# EAGLE design DUE shield (EAGLE 6.3)
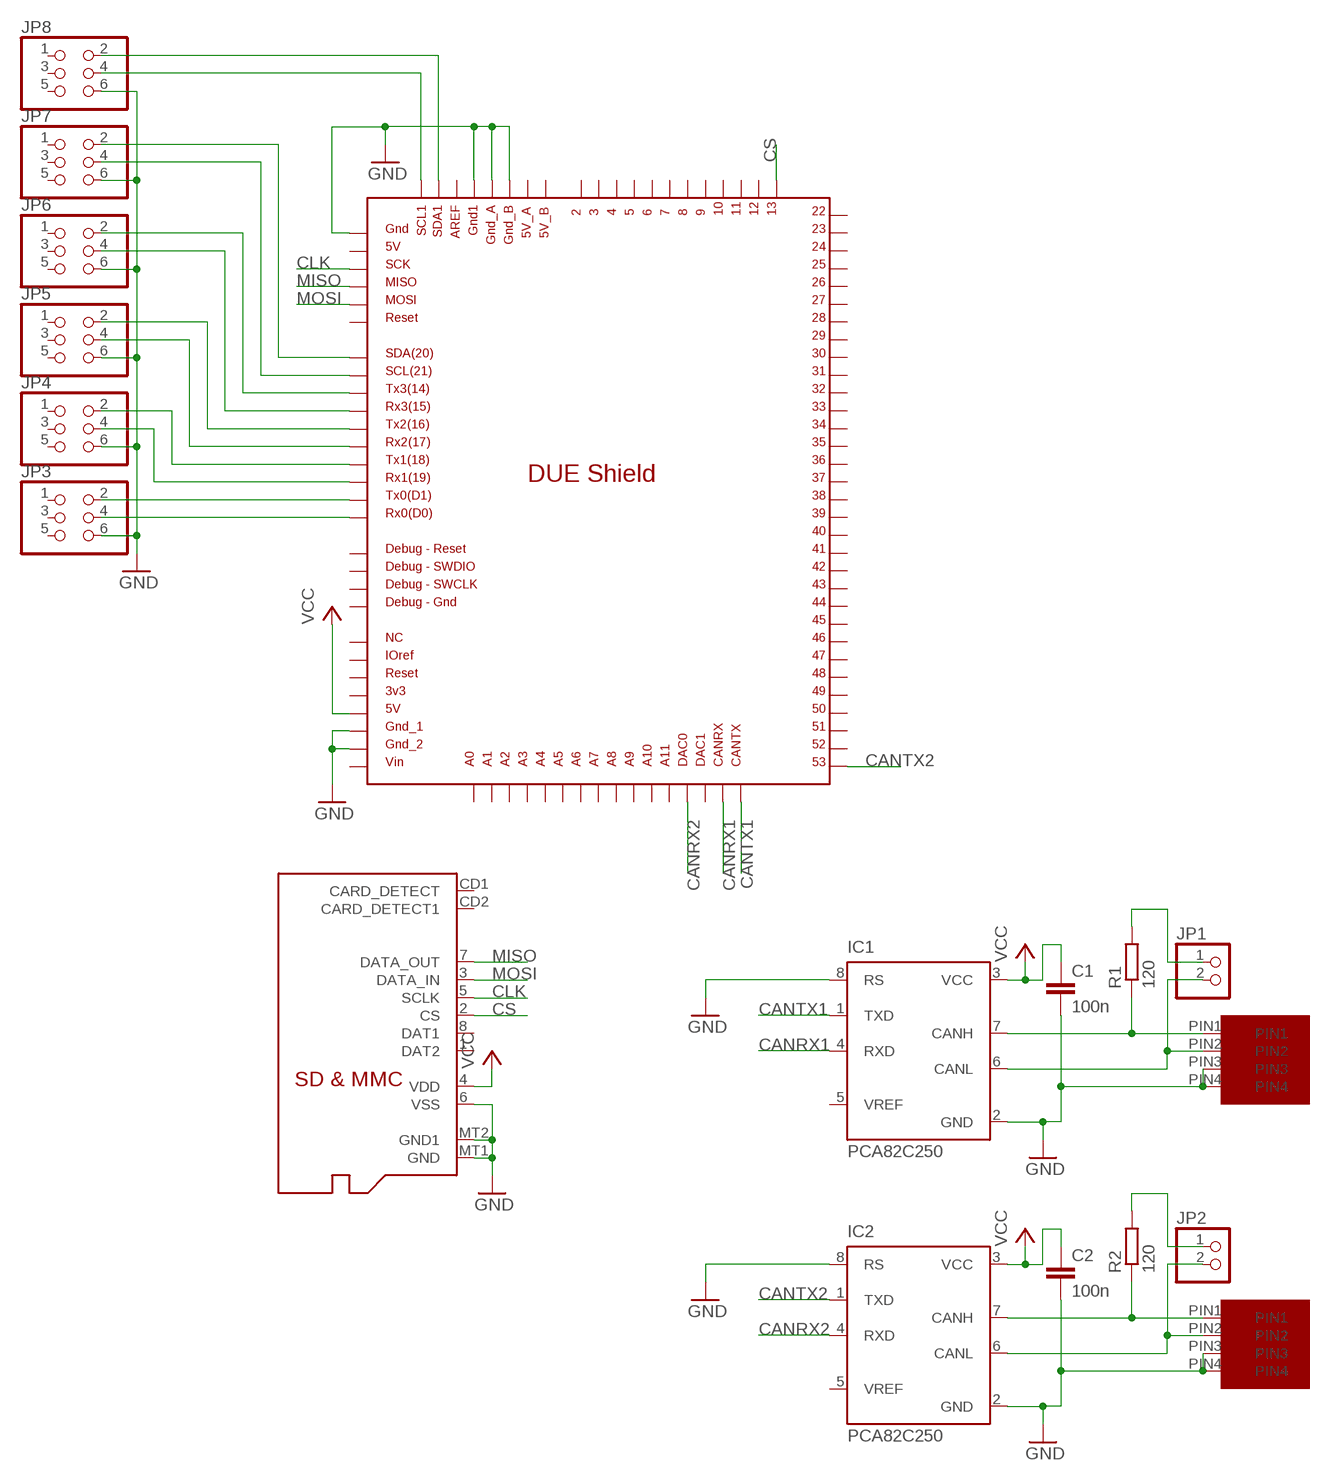
[diagram p0: schematic, sheet 1]

## Parts
C1  100n  C-EU050-024X044  [C050-024X044]
C2  100n  C-EU050-024X044  [C050-024X044]
IC1  PCA82C250  [DIL08]
IC2  PCA82C250  [DIL08]
JP1  PINHD-1X2  [1X02]
JP2  PINHD-1X2  [1X02]
JP3  PINHD-2X3  [2X03]
JP4  PINHD-2X3  [2X03]
JP5  PINHD-2X3  [2X03]
JP6  PINHD-2X3  [2X03]
JP7  PINHD-2X3  [2X03]
JP8  PINHD-2X3  [2X03]
R1  120  R-EU_0204/7  [0204/7]
R2  120  R-EU_0204/7  [0204/7]
U$1  DUE(NORMAL)  [DUE(NORMAL)]
U$2  MICROFIT4  [MICROFIT4SOCK]
U$3  MICROFIT4  [MICROFIT4SOCK]
U$4  MICROSD  [MICROSD]

## Nets
CANRX1: IC1.4(RXD) U$1.CANRX
CANRX2: IC2.4(RXD) U$1.DAC0
CANTX1: IC1.1(TXD) U$1.CANTX
CANTX2: IC2.1(TXD) U$1.53
CLK: U$1.SCK_ICSP U$4.5(SCLK)
CS: U$1.13 U$4.2(CS)
GND: C1.2 C2.2 IC1.2(GND) IC1.8(RS) IC2.2(GND) IC2.8(RS) JP3.6 JP4.6 JP5.6 JP6.6 JP7.6 JP8.6 U$1.5V_ICSP U$1.GND1 U$1.GND_1 U$1.GND_2 U$1.GND_A U$1.GND_B U$2.PIN3 U$2.PIN4 U$3.PIN3 U$3.PIN4 U$4.6(VSS) U$4.MT1(GND) U$4.MT2(GND1)
MISO: U$1.MISO_ICSP U$4.7(DATA_OUT)
MOSI: U$1.MOSI_ICSP U$4.3(DATA_IN)
N$1: IC1.7(CANH) R1.1 U$2.PIN1
N$2: IC1.6(CANL) JP1.2 U$2.PIN2
N$3: JP1.1 R1.2
N$4: JP6.2 U$1.TX3
N$5: IC2.7(CANH) R2.1 U$3.PIN1
N$6: IC2.6(CANL) JP2.2 U$3.PIN2
N$7: JP2.1 R2.2
N$8: JP6.4 U$1.RX3
N$9: JP5.2 U$1.TX2
N$10: JP5.4 U$1.RX2
N$11: JP4.2 U$1.TX1
N$12: JP4.4 U$1.RX1
N$13: JP3.2 U$1.TX0
N$14: JP3.4 U$1.RX0
N$15: JP7.4 U$1.SCL
N$16: JP7.2 U$1.SDA
N$32: JP8.4 U$1.SCL1
N$33: JP8.2 U$1.SDA1
VCC: C1.1 C2.1 IC1.3(VCC) IC2.3(VCC) U$1.5V U$4.4(VDD)
Unconnected: IC1.5(VREF) IC2.5(VREF) JP3.1 JP3.3 JP3.5 JP4.1 JP4.3 JP4.5 JP5.1 JP5.3 JP5.5 JP6.1 JP6.3 JP6.5 JP7.1 JP7.3 JP7.5 JP8.1 JP8.3 JP8.5 U$1.2 U$1.3 U$1.3V3 U$1.4 U$1.5 U$1.5V_A U$1.5V_B U$1.6 U$1.7 U$1.8 U$1.9 U$1.10 U$1.11 U$1.12 U$1.22 U$1.23 U$1.24 U$1.25 U$1.26 U$1.27 U$1.28 U$1.29 U$1.30 U$1.31 U$1.32 U$1.33 U$1.34 U$1.35 U$1.36 U$1.37 U$1.38 U$1.39 U$1.40 U$1.41 U$1.42 U$1.43 U$1.44 U$1.45 U$1.46 U$1.47 U$1.48 U$1.49 U$1.50 U$1.51 U$1.52 U$1.A0 U$1.A1 U$1.A2 U$1.A3 U$1.A4 U$1.A5 U$1.A6 U$1.A7 U$1.A8 U$1.A9 U$1.A10 U$1.A11 U$1.AREF U$1.DAC1 U$1.GND_DEBUG U$1.GND_ICSP U$1.IOREF U$1.NC U$1.RESET U$1.RESET_DEBUG U$1.RESET_ICSP U$1.SWCLK_DEBUG U$1.SWDIO_DEBUG U$1.VIN U$4.1(DAT2) U$4.8(DAT1) U$4.CD1(CARD_DETECT) U$4.CD2(CARD_DETECT1)

## Library data of the parts
C1 C2 = rcl:C-EU: CAPACITOR, European symbol
IC1 IC2 = micro-philips:PCA82C250: CAN CONTROLLER INTERFACE; OC_FARNELL: 3692358; OC_NEWARK: unknown
JP1 JP2 = pinhead:PINHD-1X2: PIN HEADER
JP3-JP8 = pinhead:PINHD-2X3: PIN HEADER
R1 R2 = resistor:R-EU_: RESISTOR, European symbol
U$1 = DUElib130425:DUE(NORMAL)
U$2 U$3 = unicorn:MICROFIT4
U$4 = adafruit:MICROSD: Micro-SD / Transflash card holder with SPI pinout For the 3M # 2908-05WB-MG and/or 4UCON #19656 push-push type

## Board
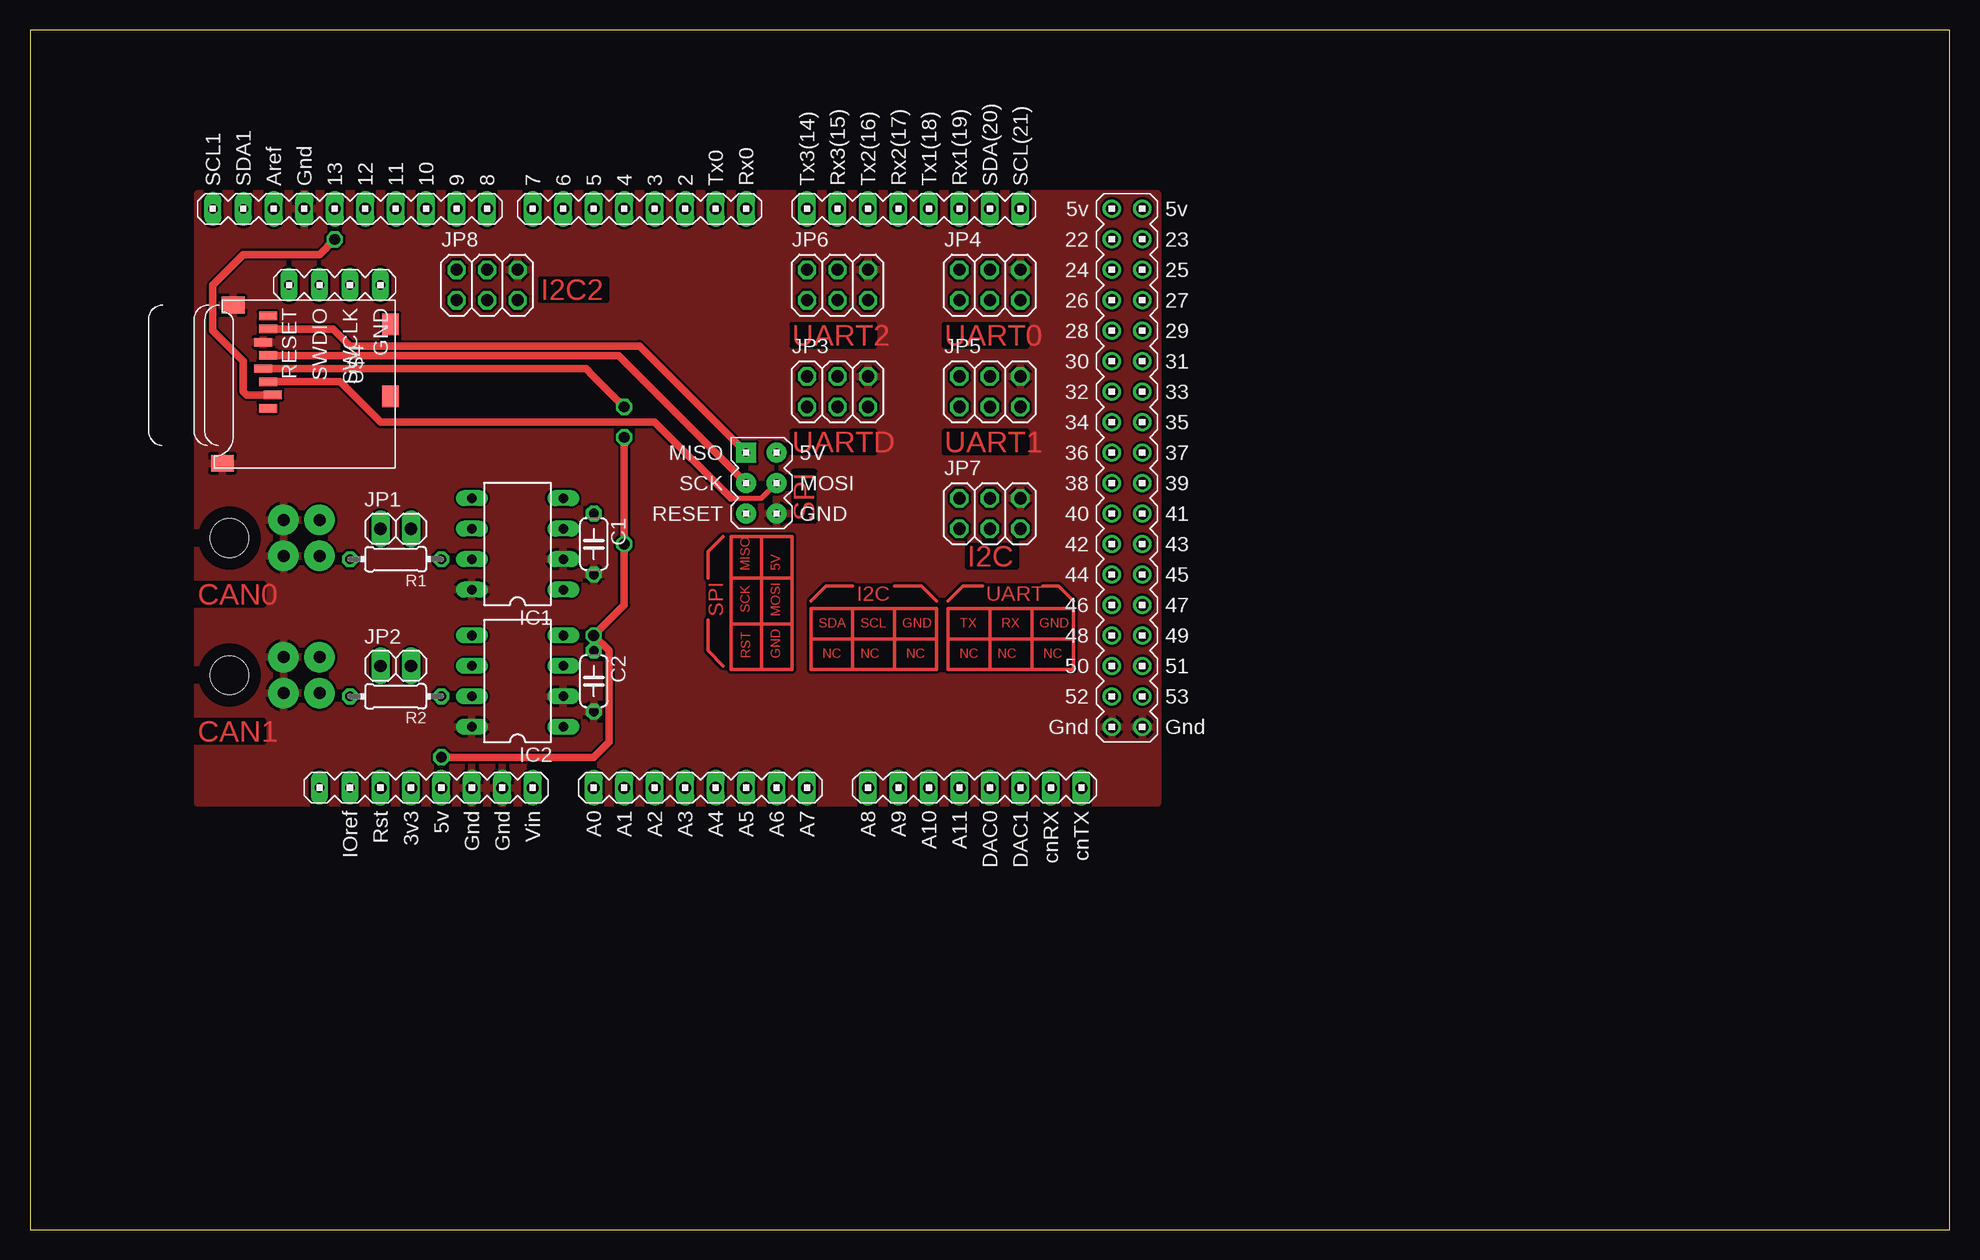
[diagram p1: board, top side]
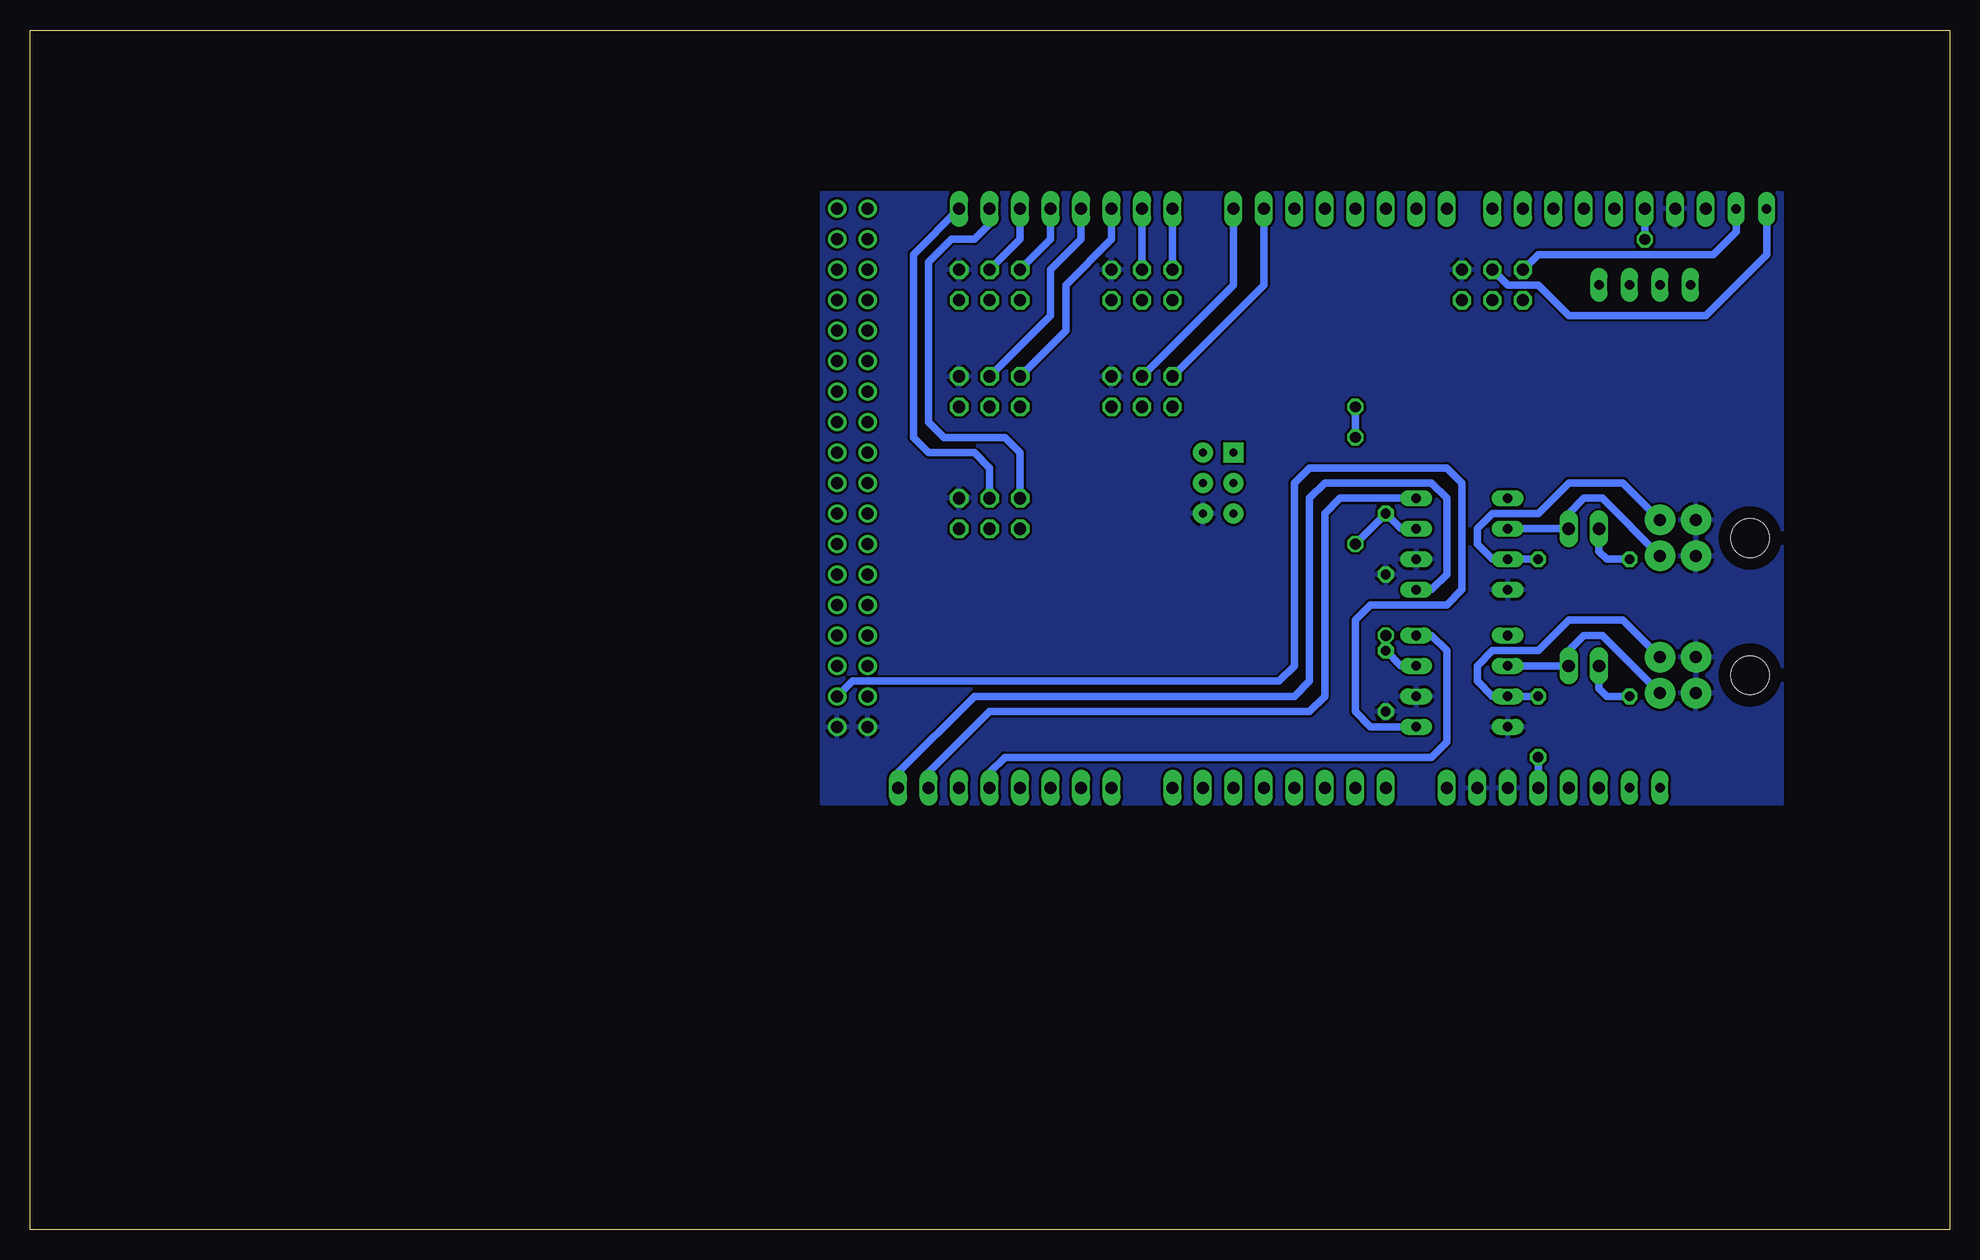
[diagram p2: board, bottom side, seen from below]

Size 160 x 100 mm. Coordinates in mm from the lower left corner, seen from the top.
Outline: 0,0 160,0 160,100 0,100 0,0
Copper layers (1*16): Top 0.035mm / dielectric 1.5mm / Bottom 0.035mm
Design rules "default": minimum track width 10mil, minimum drill 24mil, track to track 8mil, track to pad 8mil, pad to pad 8mil, via to via 8mil, smd to smd 8mil, copper to edge 40mil, drill to drill 8mil, minimum pad ring 10mil, minimum via ring 8mil, stop-mask expansion 4mil, vias tented up to drill 0mil, thermal gap 10mil

### Footprints (pad centres in the part's own frame; a part is rotated, then mirrored left to right if it is on the bottom)
C050-024X044 = drill 0.813 octagon: 1 -2.54,0; 2 2.54,0
DIL08 = drill 0.813 long: 1 -3.81,-3.81; 2 -1.27,-3.81; 3 1.27,-3.81; 4 3.81,-3.81; 5 3.81,3.81; 6 1.27,3.81; 7 -1.27,3.81; 8 -3.81,3.81
1X02 = drill 1.016 long: 1 -1.27,0; 2 1.27,0
2X03 = drill 1.016 octagon: 1 -2.54,-1.27; 2 -2.54,1.27; 3 0,-1.27; 4 0,1.27; 5 2.54,-1.27; 6 2.54,1.27
0204/7 = drill 0.813 octagon: 1 -3.81,0; 2 3.81,0
DUE(NORMAL) = drill 1 long: 2 -16.51,30.48; 3 -19.05,30.48; 3V3 -39.37,-17.78; 4 -21.59,30.48; 5 -24.13,30.48; 5V -36.83,-17.78; 6 -26.67,30.48; 7 -29.21,30.48; 8 -33.02,30.48; 9 -35.56,30.48; 10 -38.1,30.48; 11 -40.64,30.48; 12 -43.18,30.48; 13 -45.72,30.48; A0 -24.13,-17.78; A1 -21.59,-17.78; A2 -19.05,-17.78; A3 -16.51,-17.78; A4 -13.97,-17.78; A5 -11.43,-17.78; A6 -8.89,-17.78; A7 -6.35,-17.78; A8 -1.27,-17.78; A9 1.27,-17.78; A10 3.81,-17.78; A11 6.35,-17.78; AREF -50.8,30.48; AREF1 -50.8,30.48; CANRX 13.97,-17.78; CANTX 16.51,-17.78; DAC0 8.89,-17.78; DAC1 11.43,-17.78; GND1 -48.26,30.48; GND_1 -34.29,-17.78; GND_2 -31.75,-17.78; RESET -41.91,-17.78; RX0 -11.43,30.48; RX1 6.35,30.48; RX2 1.27,30.48; RX3 -3.81,30.48; SCL 11.43,30.48; SDA 8.89,30.48; TX0 -13.97,30.48; TX1 3.81,30.48; TX2 -1.27,30.48; TX3 -6.35,30.48; VIN -29.21,-17.78 | drill 1: 5V_A 19.05,30.48; 5V_B 21.59,30.48; 22 19.05,27.94; 23 21.59,27.94; 24 19.05,25.4; 25 21.59,25.4; 26 19.05,22.86; 27 21.59,22.86; 28 19.05,20.32; 29 21.59,20.32; 30 19.05,17.78; 31 21.59,17.78; 32 19.05,15.24; 33 21.59,15.24; 34 19.05,12.7; 35 21.59,12.7; 36 19.05,10.16; 37 21.59,10.16; 38 19.05,7.62; 39 21.59,7.62; 40 19.05,5.08; 41 21.59,5.08; 42 19.05,2.54; 43 21.59,2.54; 44 19.05,0; 45 21.59,0; 46 19.05,-2.54; 47 21.59,-2.54; 48 19.05,-5.08; 49 21.59,-5.08; 50 19.05,-7.62; 51 21.59,-7.62; 52 19.05,-10.16; 53 21.59,-10.16; GND_A 19.05,-12.7; GND_B 21.59,-12.7 | drill 0.7 pad 1.676: 5V_ICSP -8.89,5.08; GND_ICSP -8.89,10.16; MOSI_ICSP -8.89,7.62; RESET_ICSP -11.43,5.08; SCK_ICSP -11.43,7.62 | drill 0.8 pad 1.422 long: GND_DEBUG -41.91,24.13; IOREF -44.45,-17.78; NC -46.99,-17.78; RESET_DEBUG -49.53,24.13; SCL1 -55.88,30.48; SDA1 -53.34,30.48; SWCLK_DEBUG -44.45,24.13; SWDIO_DEBUG -46.99,24.13 | drill 0.7 pad 1.676 square: MISO_ICSP -11.43,10.16
MICROFIT4SOCK = drill 1 pad 2.54: PIN1 -2,0; PIN2 1,0; PIN3 -2,-3; PIN4 1,-3 | hole 3.2: -0.5,-7.5
MICROSD = smd 0.7 x 1.5: 1 9,-10.64; 2 7.9,-10.24; 3 6.8,-10.64; 4 5.7,-11.04; 5 4.6,-10.64; 6 3.5,-11.04; 7 2.4,-10.64; 8 1.3,-10.64 | smd 1.8 x 1.4: CD1 2,-0.44; CD2 8,-0.44 | smd 1.4 x 1.9: MT1 0.4,-13.54; MT2 13.6,-14.44

### Placement (x,y rotation side)
C1  46.99,57.15 270 top
C2  46.99,45.72 270 top
IC1  40.64,57.15 90 top
IC2  40.64,45.72 90 top
JP1  30.48,58.42 0 top
JP2  30.48,46.99 0 top
JP3  67.31,69.85 0 top
JP4  80.01,78.74 0 top
JP5  80.01,69.85 0 top
JP6  67.31,78.74 0 top
JP7  80.01,59.69 0 top
JP8  38.1,78.74 0 top
R1  30.48,55.88 180 top
R2  30.48,44.45 180 top
U$1  71.12,54.61 0 top
U$2  24.13,57.15 270 top
U$3  24.13,45.72 270 top
U$4  30.48,77.47 270 top

### Tracks (layer width: path | path; a pad name or v marks a point on that pad's centre or on a via)
CANRX1
  Bottom 0.61: IC1.4 50.8,60.96 52.07,59.69 52.07,44.45 53.34,43.18 80.01,43.18 85.09,38.1 U$1.CANRX
CANRX2
  Bottom 0.61: IC2.4 43.18,49.53 41.91,48.26 41.91,40.64 43.18,39.37 78.74,39.37 80.01,38.1 U$1.DAC0
CANTX1
  Bottom 0.61: U$1.CANTX 87.63,38.1 81.28,44.45 54.61,44.45 53.34,45.72 53.34,60.96 52.07,62.23 43.18,62.23 41.91,60.96 41.91,54.61 43.18,53.34 IC1.1
CANTX2
  Bottom 0.61: U$1.53 91.44,45.72 55.88,45.72 54.61,46.99 54.61,62.23 53.34,63.5 41.91,63.5 40.64,62.23 40.64,53.34 41.91,52.07 48.26,52.07 49.53,50.8 49.53,43.18 48.26,41.91 IC2.1
CLK
  Top 0.61: U$4.5 49.05,72.87 U$1.SCK_ICSP
CS  (via drill 0.9)
  Top 0.61: U$4.2 18.06,69.57 17.78,69.85 17.78,72.39 15.24,74.93 15.24,78.74 17.78,81.28 24.13,81.28 v25.4,82.55
  Bottom 0.61: v25.4,82.55 U$1.13
GND
  pour Bottom: 13.97,86.36 93.98,86.36 93.98,35.56 13.97,35.56
  pour Top: 13.97,86.36 93.98,86.36 93.98,35.56 13.97,35.56
MISO
  Top 0.61: U$4.7 25.26,75.07 26.67,73.66 50.8,73.66 U$1.MISO_ICSP
MOSI
  Top 0.406: 58.42,60.96 60.96,60.96 U$1.MOSI_ICSP
  Top 0.61: U$4.3 25.85,70.67 29.21,67.31 52.07,67.31 58.42,60.96
N$1
  Bottom 0.61: R1.1 IC1.7 38.1,55.88 39.37,57.15 39.37,58.42 38.1,59.69 34.29,59.69 31.75,62.23 27.21,62.23 U$2.PIN1
N$2
  Bottom 0.61: IC1.6 JP1.2 31.75,59.69 30.48,60.96 28.94,60.96 U$2.PIN2
N$3
  Bottom 0.61: R1.2 28.57,55.88 29.21,56.52 JP1.1
N$4
  Bottom 0.61: U$1.TX3 JP6.2
N$5
  Bottom 0.61: R2.1 IC2.7 38.1,44.45 39.37,45.72 39.37,46.99 38.1,48.26 34.29,48.26 31.75,50.8 27.21,50.8 U$3.PIN1
N$6
  Bottom 0.61: IC2.6 JP2.2 31.75,48.26 30.48,49.53 28.94,49.53 U$3.PIN2
N$7
  Bottom 0.61: R2.2 28.57,44.45 29.21,45.09 JP2.1
N$8
  Bottom 0.61: U$1.RX3 JP6.4
N$9
  Bottom 0.61: U$1.TX2 69.85,82.55 73.66,78.74 73.66,74.93 JP5.2
N$10
  Bottom 0.61: U$1.RX2 72.39,82.55 74.93,80.01 74.93,76.2 JP5.4
N$11
  Bottom 0.61: U$1.TX1 74.93,82.55 JP4.2
N$12
  Bottom 0.61: U$1.RX1 77.47,82.55 JP4.4
N$13
  Bottom 0.61: U$1.TX0 57.15,78.74 JP3.2
N$14
  Bottom 0.61: U$1.RX0 59.69,78.74 JP3.4
N$15
  Bottom 0.61: U$1.SCL 86.36,81.28 86.36,66.04 85.09,64.77 81.28,64.77 80.01,63.5 JP7.4
N$16
  Bottom 0.61: U$1.SDA 80.01,83.82 81.28,82.55 83.19,82.55 85.09,80.64 85.09,67.31 83.82,66.04 78.74,66.04 77.47,64.77 JP7.2
N$17
  Top 0.305: 60.96,46.67 58.42,46.67 58.42,50.48 60.96,50.48 | 60.96,46.67 63.5,46.67 63.5,50.48 60.96,50.48 | 60.96,46.67 60.96,50.48
N$18
  Top 0.305: 60.96,50.48 58.42,50.48 58.42,54.29 60.96,54.29 | 60.96,50.48 63.5,50.48 63.5,54.29 60.96,54.29 | 60.96,50.48 60.96,54.29
N$19
  Top 0.305: 60.96,54.29 58.42,54.29 58.42,57.78 60.96,57.78 | 60.96,54.29 63.5,54.29 63.5,57.78 60.96,57.78 | 60.96,54.29 60.96,57.78
N$20
  Top 0.305: 76.52,49.21 76.52,51.75 80.01,51.75 80.01,49.21 | 76.52,49.21 76.52,46.67 80.01,46.67 80.01,49.21 | 76.52,49.21 80.01,49.21
N$21
  Top 0.305: 80.01,49.21 80.01,51.75 83.5,51.75 83.5,49.21 | 80.01,49.21 80.01,46.67 83.5,46.67 83.5,49.21 | 80.01,49.21 83.5,49.21
N$22
  Top 0.305: 83.5,49.21 83.5,51.75 87,51.75 87,49.21 | 83.5,49.21 83.5,46.67 87,46.67 87,49.21 | 83.5,49.21 87,49.21
N$23
  Top 0.305: 65.09,49.21 65.09,51.75 68.58,51.75 68.58,49.21 | 65.09,49.21 65.09,46.67 68.58,46.67 68.58,49.21 | 65.09,49.21 68.58,49.21
N$24
  Top 0.305: 68.58,49.21 68.58,51.75 72.07,51.75 72.07,49.21 | 68.58,49.21 68.58,46.67 72.07,46.67 72.07,49.21 | 68.58,49.21 72.07,49.21
N$25
  Top 0.305: 72.07,49.21 72.07,51.75 75.56,51.75 75.56,49.21 | 72.07,49.21 72.07,46.67 75.56,46.67 75.56,49.21 | 72.07,49.21 75.56,49.21
N$26
  Top 0.305: 68.58,53.66 66.36,53.66 65.09,52.39
N$27
  Top 0.305: 72.07,53.66 74.3,53.66 75.56,52.39
N$28
  Top 0.305: 79.38,53.66 77.79,53.66 76.52,52.39
N$29
  Top 0.305: 84.45,53.66 85.72,53.66 87,52.39
N$30
  Top 0.305: 56.52,50.8 56.52,48.26 57.78,46.99
N$31
  Top 0.305: 56.52,54.29 56.52,56.52 57.78,57.78
N$32
  Bottom 0.61: U$1.SCL1 15.24,81.28 20.32,76.2 31.75,76.2 34.29,78.74 36.83,78.74 JP8.4
N$33
  Bottom 0.61: U$1.SDA1 17.78,83.19 19.68,81.28 34.29,81.28 JP8.2
VCC  (via drill 0.9)
  Top 0.61: v34.29,39.37 46.99,39.37 48.26,40.64 48.26,48.26 v46.99,49.53 49.53,52.07 v49.53,57.15 v49.53,66.04 | v49.53,68.58 46.99,71.12 46.34,71.77 U$4.4
  Bottom 0.61: IC1.3 45.72,58.42 C1.1 v49.53,57.15 | IC2.3 45.72,46.99 C2.1 v46.99,49.53 | U$1.5V v34.29,39.37 | v49.53,68.58 v49.53,66.04

### Text on the board
Top: I2C2 | UART2 | UART0 | UARTD | UART1 | SPI | MISO | 5V | I2C | CAN0 | I2C | UART | SPI | SCK | MOSI | SDA | SCL | GND | TX | RX | GND | RST | GND | NC | NC | NC | NC | NC | NC | CAN1